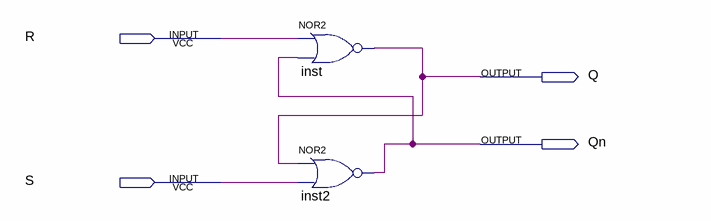
[diagram p0: schematic sheet]
// Quartus schematic lab9step1.bdf as structural Verilog: 2 symbols, 4 pins
module lab9step1 (
  input  R,
  input  S,
  output Q,
  output Qn
);

  nor inst (Q, R, Qn);
  nor inst2 (Qn, Q, S);
endmodule
